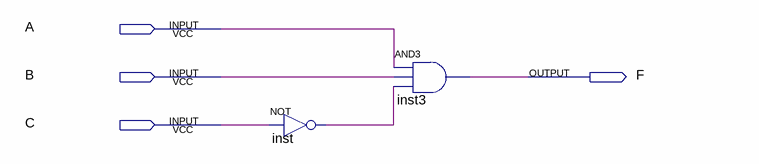
[diagram p0: schematic sheet]
// Quartus schematic lab2step1.bdf as structural Verilog: 2 symbols, 4 pins
module lab2step1 (
  input  A,
  input  B,
  input  C,
  output F
);

  wire inst_out;

  not inst (inst_out, C);
  and inst3 (F, A, B, inst_out);
endmodule
